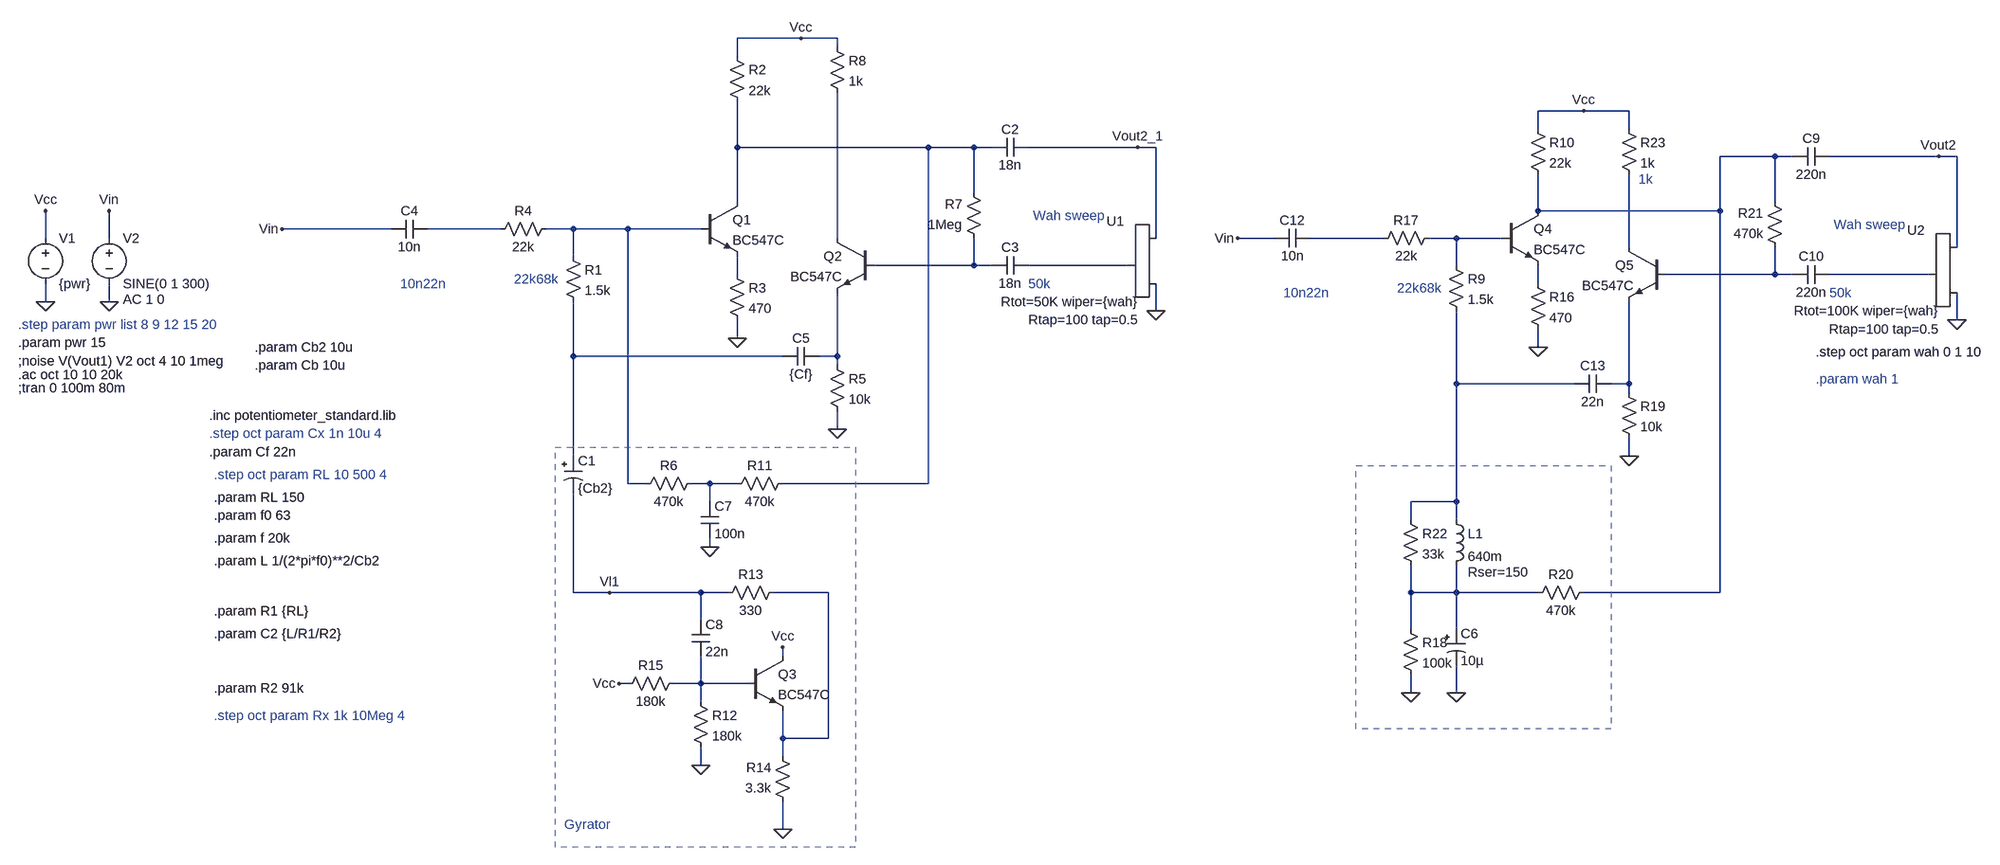
[diagram p0: schematic Gyrator Wah.asc]
Gyrator Wah.asc, the LTspice schematic file:
Version 4
SHEET 1 880 680
WIRE -1648 -2480 -1760 -2480
WIRE -1584 -2480 -1648 -2480
WIRE -1584 -2464 -1584 -2480
WIRE -1760 -2448 -1760 -2480
WIRE -272 -2352 -352 -2352
WIRE -192 -2352 -272 -2352
WIRE -352 -2320 -352 -2352
WIRE -192 -2320 -192 -2352
WIRE -1760 -2288 -1760 -2368
WIRE -1424 -2288 -1760 -2288
WIRE -1344 -2288 -1424 -2288
WIRE -1312 -2288 -1344 -2288
WIRE -1056 -2288 -1248 -2288
WIRE -1024 -2288 -1056 -2288
WIRE 64 -2272 -32 -2272
WIRE 96 -2272 64 -2272
WIRE 352 -2272 160 -2272
WIRE 384 -2272 352 -2272
WIRE -1344 -2208 -1344 -2288
WIRE -1760 -2192 -1760 -2288
WIRE 64 -2192 64 -2272
WIRE -352 -2176 -352 -2240
WIRE -32 -2176 -32 -2272
WIRE -32 -2176 -352 -2176
WIRE -2368 -2144 -2560 -2144
WIRE -2176 -2144 -2304 -2144
WIRE -2048 -2144 -2096 -2144
WIRE -1952 -2144 -2048 -2144
WIRE -1824 -2144 -1952 -2144
WIRE -2976 -2128 -2976 -2176
WIRE -2864 -2128 -2864 -2176
WIRE -1584 -2128 -1584 -2384
WIRE -1024 -2128 -1024 -2288
WIRE -816 -2128 -880 -2128
WIRE -624 -2128 -752 -2128
WIRE -496 -2128 -544 -2128
WIRE -416 -2128 -496 -2128
WIRE -192 -2112 -192 -2240
WIRE 384 -2112 384 -2272
WIRE -2048 -2096 -2048 -2144
WIRE -1344 -2080 -1344 -2128
WIRE -1344 -2080 -1520 -2080
WIRE -1312 -2080 -1344 -2080
WIRE -1072 -2080 -1248 -2080
WIRE -496 -2080 -496 -2128
WIRE -1760 -2064 -1760 -2096
WIRE 64 -2064 64 -2112
WIRE 64 -2064 -128 -2064
WIRE 96 -2064 64 -2064
WIRE 336 -2064 160 -2064
WIRE -352 -2048 -352 -2080
WIRE -2976 -2016 -2976 -2048
WIRE -2864 -2016 -2864 -2048
WIRE -1024 -2000 -1024 -2048
WIRE 384 -1984 384 -2032
WIRE -1760 -1952 -1760 -1984
WIRE -352 -1936 -352 -1968
WIRE -2048 -1920 -2048 -2016
WIRE -1680 -1920 -2048 -1920
WIRE -1584 -1920 -1584 -2032
WIRE -1584 -1920 -1616 -1920
WIRE -1584 -1904 -1584 -1920
WIRE -496 -1872 -496 -2000
WIRE -288 -1872 -496 -1872
WIRE -192 -1872 -192 -2016
WIRE -192 -1872 -224 -1872
WIRE -192 -1856 -192 -1872
WIRE -1584 -1792 -1584 -1824
WIRE -2048 -1744 -2048 -1920
WIRE -192 -1744 -192 -1776
WIRE -1952 -1696 -1952 -2144
WIRE -1920 -1696 -1952 -1696
WIRE -1808 -1696 -1840 -1696
WIRE -1760 -1696 -1808 -1696
WIRE -1424 -1696 -1424 -2288
WIRE -1424 -1696 -1680 -1696
WIRE -1808 -1664 -1808 -1696
WIRE -496 -1664 -496 -1872
WIRE -496 -1664 -576 -1664
WIRE -576 -1632 -576 -1664
WIRE -496 -1632 -496 -1664
WIRE -1808 -1584 -1808 -1600
WIRE -2048 -1504 -2048 -1680
WIRE -1984 -1504 -2048 -1504
WIRE -1824 -1504 -1984 -1504
WIRE -1776 -1504 -1824 -1504
WIRE -1600 -1504 -1696 -1504
WIRE -576 -1504 -576 -1552
WIRE -496 -1504 -496 -1552
WIRE -496 -1504 -576 -1504
WIRE -352 -1504 -496 -1504
WIRE -32 -1504 -32 -2176
WIRE -32 -1504 -272 -1504
WIRE -1824 -1456 -1824 -1504
WIRE -576 -1440 -576 -1504
WIRE -496 -1440 -496 -1504
WIRE -1680 -1392 -1680 -1408
WIRE -1952 -1344 -1968 -1344
WIRE -1824 -1344 -1824 -1392
WIRE -1824 -1344 -1872 -1344
WIRE -1744 -1344 -1824 -1344
WIRE -576 -1328 -576 -1360
WIRE -496 -1328 -496 -1376
WIRE -1824 -1312 -1824 -1344
WIRE -1680 -1248 -1680 -1296
WIRE -1600 -1248 -1600 -1504
WIRE -1600 -1248 -1680 -1248
WIRE -1680 -1216 -1680 -1248
WIRE -1824 -1200 -1824 -1232
WIRE -1680 -1088 -1680 -1136
FLAG -2560 -2144 Vin
FLAG -1760 -1952 0
FLAG -1584 -1792 0
FLAG -1648 -2480 Vcc
FLAG -1024 -2000 0
FLAG -1056 -2288 Vout2_1
FLAG -1808 -1584 0
FLAG -1680 -1408 Vcc
FLAG -1824 -1200 0
FLAG -1984 -1504 Vl1
FLAG -1680 -1088 0
FLAG -1968 -1344 Vcc
FLAG -352 -1936 0
FLAG -576 -1328 0
FLAG -496 -1328 0
FLAG -192 -1744 0
FLAG -272 -2352 Vcc
FLAG 384 -1984 0
FLAG 352 -2272 Vout2
FLAG -880 -2128 Vin
FLAG -2976 -2016 0
FLAG -2976 -2176 Vcc
FLAG -2864 -2016 0
FLAG -2864 -2176 Vin
SYMBOL npn -1824 -2192 R0
SYMATTR InstName Q1
SYMATTR Value BC547C
SYMBOL res -2064 -2112 R0
SYMATTR InstName R1
SYMATTR Value 1.5k
SYMBOL res -1776 -2464 R0
SYMATTR InstName R2
SYMATTR Value 22k
SYMBOL res -1776 -2080 R0
SYMATTR InstName R3
SYMATTR Value 470
SYMBOL res -2080 -2160 R90
WINDOW 0 0 56 VBottom 2
WINDOW 3 32 56 VTop 2
SYMATTR InstName R4
SYMATTR Value 22k
SYMBOL polcap -2064 -1744 R0
SYMATTR InstName C1
SYMATTR Value {Cb2}
SYMATTR Description Capacitor
SYMATTR Type cap
SYMATTR SpiceLine V=25 Irms=39m Rser=2.8 Lser=0 mfg="Nichicon" pn="UPR1E100MAH" type="Al electrolytic"
SYMBOL npn -1520 -2128 M0
SYMATTR InstName Q2
SYMATTR Value BC547C
SYMBOL res -1600 -1920 R0
SYMATTR InstName R5
SYMATTR Value 10k
SYMBOL res -1824 -1712 R90
WINDOW 0 0 56 VBottom 2
WINDOW 3 32 56 VTop 2
SYMATTR InstName R6
SYMATTR Value 470k
SYMBOL res -1328 -2112 R180
WINDOW 0 36 76 Left 2
WINDOW 3 36 40 Left 2
SYMATTR InstName R7
SYMATTR Value 1Meg
SYMBOL cap -1248 -2304 R90
WINDOW 0 0 32 VBottom 2
WINDOW 3 32 32 VTop 2
SYMATTR InstName C2
SYMATTR Value 18n
SYMBOL cap -1248 -2096 R90
WINDOW 0 0 32 VBottom 2
WINDOW 3 32 32 VTop 2
SYMATTR InstName C3
SYMATTR Value 18n
SYMBOL cap -2304 -2160 R90
WINDOW 0 0 32 VBottom 2
WINDOW 3 32 32 VTop 2
SYMATTR InstName C4
SYMATTR Value 10n
SYMBOL cap -1616 -1936 R90
WINDOW 0 0 32 VBottom 2
WINDOW 3 32 32 VTop 2
SYMATTR InstName C5
SYMATTR Value {Cf}
SYMBOL res -1600 -2480 R0
SYMATTR InstName R8
SYMATTR Value 1k
SYMBOL potentiometer_standard -1008 -2144 M0
WINDOW 3 48 128 Left 2
WINDOW 39 46 160 Left 2
SYMATTR Value Rtot=50K wiper={wah}
SYMATTR SpiceLine Rtap=100 tap=0.5
SYMATTR InstName U1
SYMATTR SpiceModel pot_plog
SYMBOL res -1664 -1712 R90
WINDOW 0 0 56 VBottom 2
WINDOW 3 32 56 VTop 2
SYMATTR InstName R11
SYMATTR Value 470k
SYMBOL cap -1824 -1664 R0
SYMATTR InstName C7
SYMATTR Value 100n
SYMBOL npn -1744 -1392 R0
SYMATTR InstName Q3
SYMATTR Value BC547C
SYMBOL res -1840 -1328 R0
SYMATTR InstName R12
SYMATTR Value 180k
SYMBOL cap -1840 -1456 R0
SYMATTR InstName C8
SYMATTR Value 22n
SYMBOL res -1680 -1520 R90
WINDOW 0 0 56 VBottom 2
WINDOW 3 32 56 VTop 2
SYMATTR InstName R13
SYMATTR Value 330
SYMBOL res -1664 -1120 R180
WINDOW 0 36 76 Left 2
WINDOW 3 36 40 Left 2
SYMATTR InstName R14
SYMATTR Value 3.3k
SYMBOL res -1856 -1360 R90
WINDOW 0 0 56 VBottom 2
WINDOW 3 32 56 VTop 2
SYMATTR InstName R15
SYMATTR Value 180k
SYMBOL npn -416 -2176 R0
SYMATTR InstName Q4
SYMATTR Value BC547C
SYMBOL res -512 -2096 R0
SYMATTR InstName R9
SYMATTR Value 1.5k
SYMBOL res -368 -2336 R0
SYMATTR InstName R10
SYMATTR Value 22k
SYMBOL res -368 -2064 R0
SYMATTR InstName R16
SYMATTR Value 470
SYMBOL res -528 -2144 R90
WINDOW 0 0 56 VBottom 2
WINDOW 3 32 56 VTop 2
SYMATTR InstName R17
SYMATTR Value 22k
SYMBOL res -592 -1456 R0
SYMATTR InstName R18
SYMATTR Value 100k
SYMBOL polcap -512 -1440 R0
SYMATTR InstName C6
SYMATTR Value 10µ
SYMATTR Description Capacitor
SYMATTR Type cap
SYMATTR SpiceLine V=25 Irms=39m Rser=2.8 Lser=0 mfg="Nichicon" pn="UPR1E100MAH" type="Al electrolytic"
SYMBOL npn -128 -2112 M0
SYMATTR InstName Q5
SYMATTR Value BC547C
SYMBOL res -208 -1872 R0
SYMATTR InstName R19
SYMATTR Value 10k
SYMBOL res -256 -1520 R90
WINDOW 0 0 56 VBottom 2
WINDOW 3 32 56 VTop 2
SYMATTR InstName R20
SYMATTR Value 470k
SYMBOL res 80 -2096 R180
WINDOW 0 36 76 Left 2
WINDOW 3 36 40 Left 2
SYMATTR InstName R21
SYMATTR Value 470k
SYMBOL cap 160 -2288 R90
WINDOW 0 0 32 VBottom 2
WINDOW 3 32 32 VTop 2
SYMATTR InstName C9
SYMATTR Value 220n
SYMBOL cap 160 -2080 R90
WINDOW 0 0 32 VBottom 2
WINDOW 3 32 32 VTop 2
SYMATTR InstName C10
SYMATTR Value 220n
SYMBOL cap -752 -2144 R90
WINDOW 0 0 32 VBottom 2
WINDOW 3 32 32 VTop 2
SYMATTR InstName C12
SYMATTR Value 10n
SYMBOL res -592 -1648 R0
SYMATTR InstName R22
SYMATTR Value 33k
SYMBOL cap -224 -1888 R90
WINDOW 0 0 32 VBottom 2
WINDOW 3 32 32 VTop 2
SYMATTR InstName C13
SYMATTR Value 22n
SYMBOL res -208 -2336 R0
SYMATTR InstName R23
SYMATTR Value 1k
SYMBOL potentiometer_standard 400 -2128 M0
WINDOW 3 48 128 Left 2
WINDOW 39 46 160 Left 2
SYMATTR Value Rtot=100K wiper={wah}
SYMATTR SpiceLine Rtap=100 tap=0.5
SYMATTR InstName U2
SYMATTR SpiceModel pot_plog
SYMBOL ind -512 -1648 R0
WINDOW 39 36 108 Left 2
SYMATTR SpiceLine Rser=150
SYMATTR InstName L1
SYMATTR Value 640m
SYMBOL voltage -2976 -2144 R0
WINDOW 123 0 0 Left 2
WINDOW 39 0 0 Left 2
SYMATTR InstName V1
SYMATTR Value {pwr}
SYMBOL voltage -2864 -2144 R0
WINDOW 123 24 124 Left 2
WINDOW 39 0 0 Left 2
SYMATTR Value2 AC 1 0
SYMATTR InstName V2
SYMATTR Value SINE(0 1 300)
TEXT -1248 -2048 Left 2 ;50k
TEXT -1240 -2168 Left 2 ;Wah sweep
TEXT -2352 -2048 Left 2 ;10n22n
TEXT -2152 -2056 Left 2 ;22k68k
TEXT -176 -2232 Left 2 ;1k
TEXT 136 -1928 Left 2 !.step oct param wah 0 1 10
TEXT 160 -2032 Left 2 ;50k
TEXT 168 -2152 Left 2 ;Wah sweep
TEXT 136 -1880 Left 2 ;.param wah 1
TEXT -800 -2032 Left 2 ;10n22n
TEXT -600 -2040 Left 2 ;22k68k
TEXT -2688 -1784 Left 2 ;.step oct param Cx 1n 10u 4
TEXT -2688 -1752 Left 2 !.param Cf 22n
TEXT -2680 -1712 Left 2 ;.step oct param RL 10 500 4
TEXT -2680 -1672 Left 2 !.param RL 150
TEXT -2680 -1560 Left 2 !.param L 1/(2*pi*f0)**2/Cb2
TEXT -2680 -1472 Left 2 !.param R1 {RL}
TEXT -2680 -1600 Left 2 !.param f 20k
TEXT -2680 -1432 Left 2 !.param C2 {L/R1/R2}
TEXT -2680 -1336 Left 2 !.param R2 91k
TEXT -3024 -1864 Left 2 !;tran 0 100m 80m
TEXT -3024 -1888 Left 2 !.ac oct 10 10 20k
TEXT -3024 -1912 Left 2 !;noise V(Vout1) V2 oct 4 10 1meg
TEXT -3024 -1976 Left 2 ;.step param pwr list 8 9 12 15 20
TEXT -3024 -1944 Left 2 !.param pwr 15
TEXT -2688 -1816 Left 2 !.inc potentiometer_standard.lib
TEXT -2608 -1936 Left 2 !.param Cb2 10u
TEXT -2608 -1904 Left 2 !.param Cb 10u
TEXT -2680 -1288 Left 2 ;.step oct param Rx 1k 10Meg 4
TEXT -2680 -1640 Left 2 !.param f0 63
TEXT -2064 -1096 Left 2 ;Gyrator
RECTANGLE Normal -224 -1264 -672 -1728 2
RECTANGLE Normal -1552 -1056 -2080 -1760 2

The netlist it stands for:
* Gyrator Wah.asc
Q1 N001 N004 N011 0 BC547C
R1 N004 N015 1.5k
R2 Vcc N001 22k
R3 N011 0 470
R4 N004 N003 22k
C1 N015 Vl1 {Cb2} V=25 Irms=39m Rser=2.8 Lser=0 mfg="Nichicon" pn="UPR1E100MAH" type="Al electrolytic"
Q2 N005 N009 N016 0 BC547C
R5 N016 0 10k
R6 N019 N004 470k
R7 N009 N001 1Meg
C2 Vout2_1 N001 18n
C3 N010 N009 18n
C4 N003 Vin 10n
C5 N016 N015 {Cf}
R8 Vcc N005 1k
XU1 Vout2_1 0 N010 pot_plog Rtot=50K wiper={wah} Rtap=100 tap=0.5
R11 N001 N019 470k
C7 N019 0 100n
Q3 Vcc N022 N020 0 BC547C
R12 N022 0 180k
C8 Vl1 N022 22n
R13 N020 Vl1 330
R14 0 N020 3.3k
R15 N022 Vcc 180k
Q4 N002 N007 N014 0 BC547C
R9 N007 N017 1.5k
R10 Vcc N002 22k
R16 N014 0 470
R17 N007 N006 22k
R18 N021 0 100k
C6 N021 0 10µ V=25 Irms=39m Rser=2.8 Lser=0 mfg="Nichicon" pn="UPR1E100MAH" type="Al electrolytic"
Q5 N008 N012 N018 0 BC547C
R19 N018 0 10k
R20 N002 N021 470k
R21 N012 N002 470k
C9 Vout2 N002 220n
C10 N013 N012 220n
C12 N006 Vin 10n
R22 N017 N021 33k
C13 N018 N017 22n
R23 Vcc N008 1k
XU2 Vout2 0 N013 pot_plog Rtot=100K wiper={wah} Rtap=100 tap=0.5
L1 N017 N021 640m Rser=150
V1 Vcc 0 {pwr}
V2 Vin 0 SINE(0 1 300) AC 1 0
.model NPN NPN
.model PNP PNP
.lib standard.bjt
* 50k
* Wah sweep
* 10n22n
* 22k68k
* 1k
.step oct param wah 0 1 10
* 50k
* Wah sweep
* .param wah 1
* 10n22n
* 22k68k
* .step oct param Cx 1n 10u 4
.param Cf 22n
* .step oct param RL 10 500 4
.param RL 150
.param L 1/(2*pi*f0)**2/Cb2
.param R1 {RL}
.param f 20k
.param C2 {L/R1/R2}
.param R2 91k
;tran 0 100m 80m
.ac oct 10 10 20k
;noise V(Vout1) V2 oct 4 10 1meg
* .step param pwr list 8 9 12 15 20
.param pwr 15
.inc potentiometer_standard.lib
.param Cb2 10u
.param Cb 10u
* .step oct param Rx 1k 10Meg 4
.param f0 63
* Gyrator
.backanno
.end